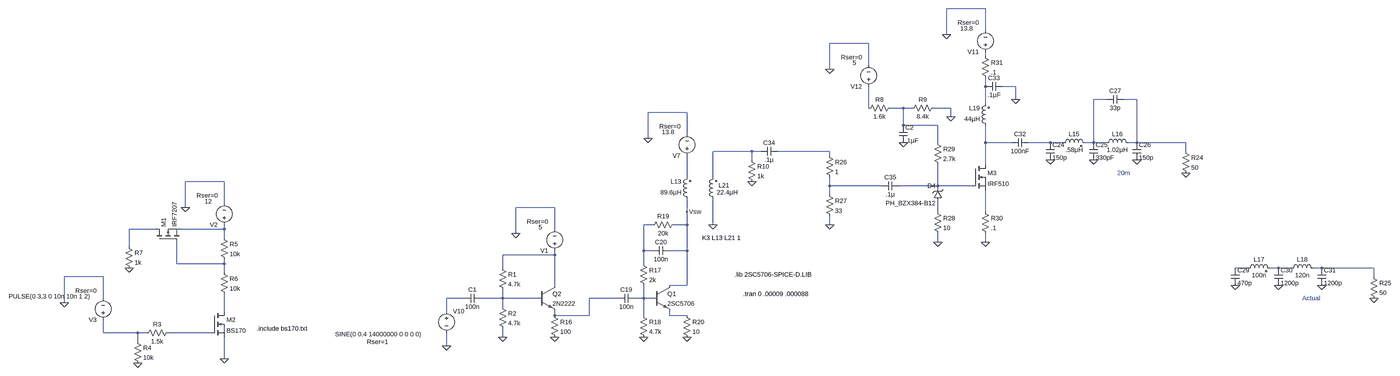
[diagram p0: schematic 10W IRF510 Amp - preamp v2.asc, whole sheet]
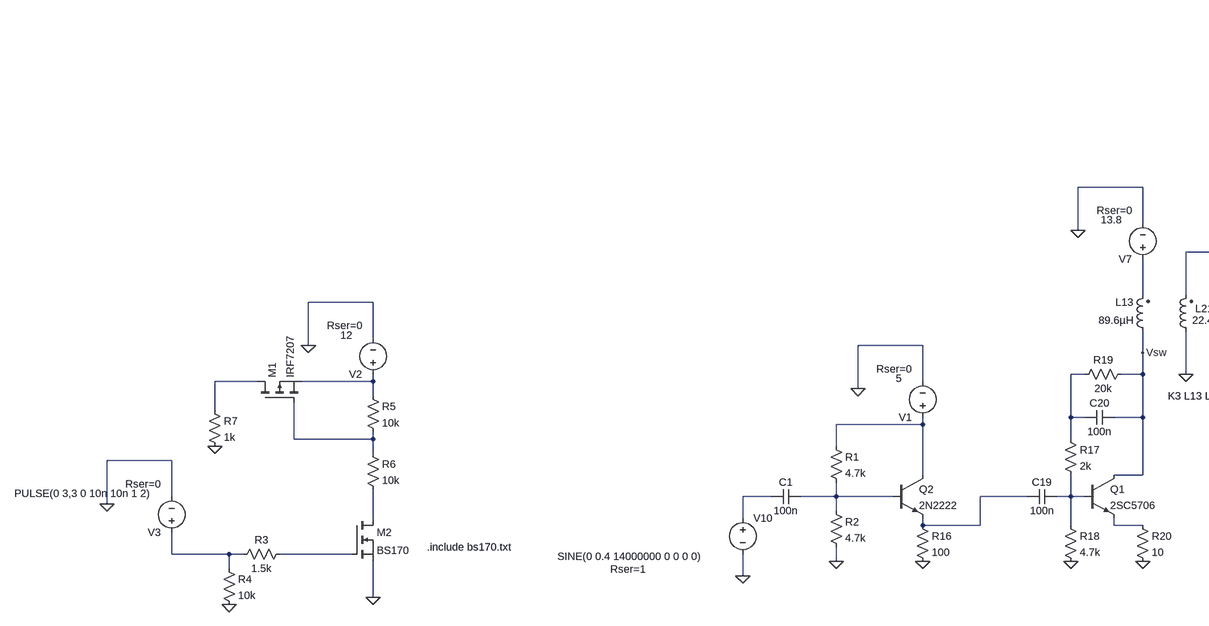
[diagram p1: schematic 10W IRF510 Amp - preamp v2.asc, part, row 1 of 1, column 1 of 2]
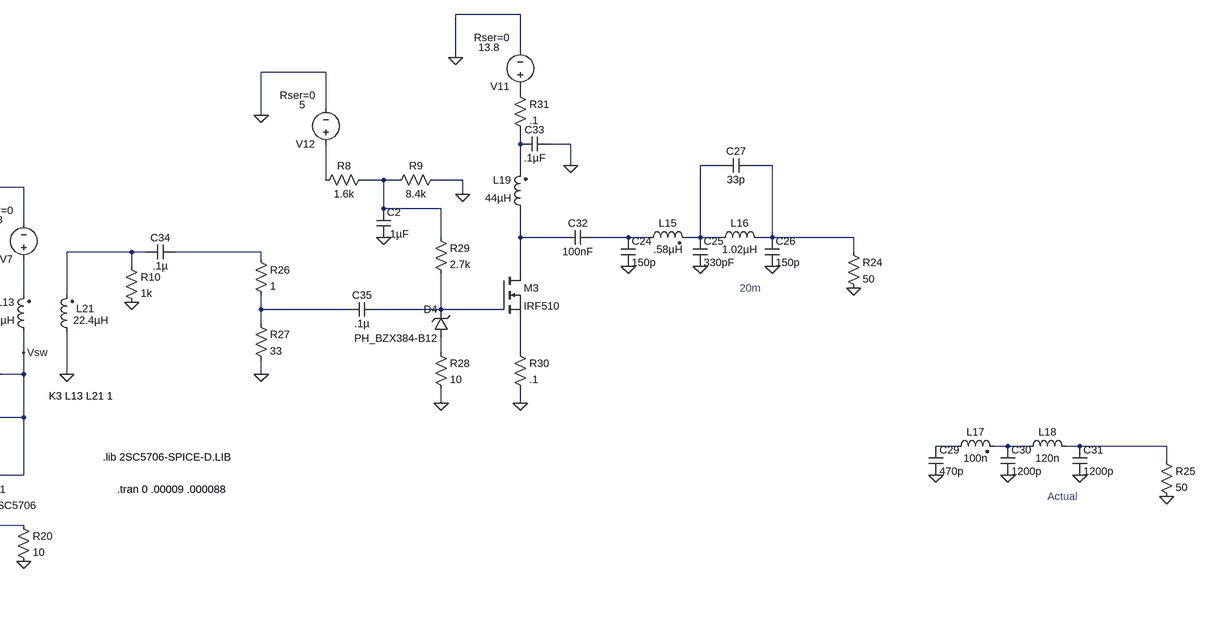
[diagram p2: schematic 10W IRF510 Amp - preamp v2.asc, part, row 1 of 1, column 2 of 2]
10W IRF510 Amp - preamp v2.asc, the LTspice schematic file:
Version 4
SHEET 1 3764 1240
WIRE 416 -3552 272 -3552
WIRE 416 -3472 416 -3552
WIRE 272 -3456 272 -3552
WIRE -16 -3424 -160 -3424
WIRE 416 -3376 416 -3392
WIRE -16 -3344 -16 -3424
WIRE -160 -3328 -160 -3424
WIRE 416 -3264 416 -3296
WIRE 528 -3264 480 -3264
WIRE 528 -3216 528 -3264
WIRE 864 -3216 816 -3216
WIRE 976 -3216 928 -3216
WIRE 416 -3200 416 -3264
WIRE -16 -3184 -16 -3264
WIRE 112 -3184 64 -3184
WIRE 144 -3184 112 -3184
WIRE 288 -3184 224 -3184
WIRE -688 -3168 -832 -3168
WIRE 288 -3152 288 -3184
WIRE 112 -3120 112 -3184
WIRE 240 -3120 112 -3120
WIRE -688 -3088 -688 -3168
WIRE -832 -3072 -832 -3168
WIRE 240 -3056 240 -3120
WIRE 416 -3056 416 -3120
WIRE 512 -3056 416 -3056
WIRE 656 -3056 576 -3056
WIRE 704 -3056 656 -3056
WIRE 816 -3056 816 -3216
WIRE 816 -3056 784 -3056
WIRE 864 -3056 816 -3056
WIRE 976 -3056 976 -3216
WIRE 976 -3056 944 -3056
WIRE 1344 -3056 976 -3056
WIRE -448 -3024 -592 -3024
WIRE -416 -3024 -448 -3024
WIRE -160 -3024 -352 -3024
WIRE 1344 -3024 1344 -3056
WIRE -160 -3008 -160 -3024
WIRE -448 -2992 -448 -3024
WIRE 416 -2976 416 -3056
WIRE -688 -2928 -688 -3008
WIRE -592 -2928 -592 -3024
WIRE -3536 -2912 -3680 -2912
WIRE -160 -2896 -160 -2928
WIRE 32 -2896 -160 -2896
WIRE 240 -2896 240 -2976
WIRE 240 -2896 96 -2896
WIRE 368 -2896 240 -2896
WIRE -160 -2864 -160 -2896
WIRE -3536 -2832 -3536 -2912
WIRE -3680 -2816 -3680 -2912
WIRE -1184 -2816 -1328 -2816
WIRE -688 -2800 -688 -2848
WIRE 240 -2800 240 -2832
WIRE 416 -2800 416 -2880
WIRE -816 -2752 -848 -2752
WIRE -688 -2752 -688 -2800
WIRE -688 -2752 -736 -2752
WIRE -592 -2752 -592 -2848
WIRE -160 -2752 -160 -2784
WIRE -3792 -2736 -3888 -2736
WIRE -3536 -2736 -3536 -2752
WIRE -3536 -2736 -3696 -2736
WIRE -1184 -2736 -1184 -2816
WIRE -1328 -2720 -1328 -2816
WIRE -3536 -2704 -3536 -2736
WIRE 240 -2688 240 -2720
WIRE 416 -2688 416 -2720
WIRE -3888 -2672 -3888 -2736
WIRE -848 -2656 -848 -2752
WIRE -816 -2656 -848 -2656
WIRE -688 -2656 -688 -2752
WIRE -688 -2656 -752 -2656
WIRE -1184 -2640 -1184 -2656
WIRE -1184 -2640 -1376 -2640
WIRE -3712 -2608 -3712 -2688
WIRE -3536 -2608 -3536 -2624
WIRE -3536 -2608 -3712 -2608
WIRE -848 -2608 -848 -2656
WIRE -1376 -2592 -1376 -2640
WIRE 2528 -2592 2480 -2592
WIRE 2640 -2592 2608 -2592
WIRE 2688 -2592 2640 -2592
WIRE 2800 -2592 2768 -2592
WIRE 3168 -2592 2800 -2592
WIRE -3536 -2576 -3536 -2608
WIRE -3984 -2560 -4128 -2560
WIRE 3168 -2560 3168 -2592
WIRE -1184 -2528 -1184 -2640
WIRE -688 -2528 -688 -2656
WIRE -688 -2528 -752 -2528
WIRE -3984 -2480 -3984 -2560
WIRE -1520 -2480 -1584 -2480
WIRE -1376 -2480 -1376 -2512
WIRE -1376 -2480 -1456 -2480
WIRE -1248 -2480 -1376 -2480
WIRE -944 -2480 -1056 -2480
WIRE -848 -2480 -848 -2528
WIRE -848 -2480 -880 -2480
WIRE -816 -2480 -848 -2480
WIRE -4128 -2464 -4128 -2560
WIRE -1376 -2448 -1376 -2480
WIRE -3536 -2432 -3536 -2496
WIRE -1584 -2432 -1584 -2480
WIRE -1184 -2416 -1184 -2432
WIRE -1056 -2416 -1056 -2480
WIRE -1056 -2416 -1184 -2416
WIRE -848 -2416 -848 -2480
WIRE -752 -2416 -752 -2432
WIRE -688 -2416 -752 -2416
WIRE -3984 -2352 -3984 -2400
WIRE -3856 -2352 -3984 -2352
WIRE -3824 -2352 -3856 -2352
WIRE -3584 -2352 -3744 -2352
WIRE -1376 -2336 -1376 -2368
WIRE -3856 -2320 -3856 -2352
WIRE -1584 -2304 -1584 -2352
WIRE -3536 -2256 -3536 -2336
FLAG -832 -3072 0
FLAG -1184 -2336 0
FLAG -848 -2336 0
FLAG -688 -2336 0
FLAG -688 -2800 Vsw
FLAG -1584 -2304 0
FLAG 1344 -2944 0
FLAG 656 -2992 0
FLAG 816 -2992 0
FLAG 976 -2992 0
FLAG 3168 -2480 0
FLAG 2480 -2528 0
FLAG 2640 -2528 0
FLAG 2800 -2528 0
FLAG 272 -3456 0
FLAG 528 -3216 0
FLAG -592 -2752 0
FLAG -160 -2752 0
FLAG 240 -2688 0
FLAG 416 -2688 0
FLAG -160 -3328 0
FLAG -1328 -2720 0
FLAG -1376 -2336 0
FLAG -3536 -2256 0
FLAG -3856 -2240 0
FLAG -3680 -2816 0
FLAG -4128 -2464 0
FLAG -3888 -2592 0
FLAG 288 -3152 0
FLAG 112 -3056 0
FLAG -448 -2912 0
SYMBOL npn -816 -2528 R0
SYMATTR InstName Q1
SYMATTR Value 2SC5706
SYMBOL voltage -688 -2992 R180
WINDOW 123 0 0 Left 0
WINDOW 39 24 124 Left 2
WINDOW 3 46 103 Left 2
SYMATTR SpiceLine Rser=0
SYMATTR Value 13.8
SYMATTR InstName V7
SYMBOL npn -1248 -2528 R0
SYMATTR InstName Q2
SYMATTR Value 2N2222
SYMBOL res -1200 -2432 R0
SYMATTR InstName R16
SYMATTR Value 100
SYMBOL cap -880 -2496 R90
WINDOW 0 0 32 VBottom 2
WINDOW 3 32 32 VTop 2
SYMATTR InstName C19
SYMATTR Value 100n
SYMBOL res -864 -2624 R0
SYMATTR InstName R17
SYMATTR Value 2k
SYMBOL res -864 -2432 R0
SYMATTR InstName R18
SYMATTR Value 4.7k
SYMBOL res -720 -2768 R90
WINDOW 0 0 56 VBottom 2
WINDOW 3 32 56 VTop 2
SYMATTR InstName R19
SYMATTR Value 20k
SYMBOL cap -752 -2672 R90
WINDOW 0 0 32 VBottom 2
WINDOW 3 32 32 VTop 2
SYMATTR InstName C20
SYMATTR Value 100n
SYMBOL ind2 -672 -2832 R180
WINDOW 0 36 80 Left 2
WINDOW 3 36 40 Left 2
SYMATTR InstName L13
SYMATTR Value 89.6µH
SYMATTR Type ind
SYMBOL res -704 -2432 R0
SYMATTR InstName R20
SYMATTR Value 10
SYMBOL voltage -1584 -2448 R0
WINDOW 123 0 0 Left 0
WINDOW 39 -295 129 Left 2
WINDOW 3 -412 101 Left 2
SYMATTR SpiceLine Rser=1
SYMATTR Value SINE(0 0.4 14000000 0 0 0 0)
SYMATTR InstName V10
SYMBOL res 1328 -3040 R0
SYMATTR InstName R24
SYMATTR Value 50
SYMBOL cap 640 -3056 R0
SYMATTR InstName C24
SYMATTR Value 150p
SYMBOL cap 800 -3056 R0
SYMATTR InstName C25
SYMATTR Value 330pF
SYMBOL cap 960 -3056 R0
SYMATTR InstName C26
SYMATTR Value 150p
SYMBOL ind2 688 -3040 R270
WINDOW 0 32 56 VTop 2
WINDOW 3 5 56 VBottom 2
SYMATTR InstName L15
SYMATTR Value .58µH
SYMATTR Type ind
SYMBOL ind 848 -3040 R270
WINDOW 0 32 56 VTop 2
WINDOW 3 5 56 VBottom 2
SYMATTR InstName L16
SYMATTR Value 1.02µH
SYMBOL cap 928 -3232 R90
WINDOW 0 0 32 VBottom 2
WINDOW 3 32 32 VTop 2
SYMATTR InstName C27
SYMATTR Value 33p
SYMBOL res 3152 -2576 R0
SYMATTR InstName R25
SYMATTR Value 50
SYMBOL cap 2464 -2592 R0
SYMATTR InstName C29
SYMATTR Value 470p
SYMBOL cap 2624 -2592 R0
SYMATTR InstName C30
SYMATTR Value 1200p
SYMBOL cap 2784 -2592 R0
SYMATTR InstName C31
SYMATTR Value 1200p
SYMBOL ind2 2512 -2576 R270
WINDOW 0 32 56 VTop 2
WINDOW 3 5 56 VBottom 2
SYMATTR InstName L17
SYMATTR Value 100n
SYMATTR Type ind
SYMBOL ind 2672 -2576 R270
WINDOW 0 32 56 VTop 2
WINDOW 3 5 56 VBottom 2
SYMATTR InstName L18
SYMATTR Value 120n
SYMBOL voltage 416 -3376 R180
WINDOW 123 0 0 Left 0
WINDOW 39 24 124 Left 2
WINDOW 3 46 103 Left 2
SYMATTR SpiceLine Rser=0
SYMATTR Value 13.8
SYMATTR InstName V11
SYMBOL ind2 432 -3104 R180
WINDOW 0 36 80 Left 2
WINDOW 3 36 40 Left 2
SYMATTR InstName L19
SYMATTR Value 44µH
SYMATTR Type ind
SYMBOL cap 576 -3072 R90
WINDOW 0 0 32 VBottom 2
WINDOW 3 32 32 VTop 2
SYMATTR InstName C32
SYMATTR Value 100nF
SYMBOL ind2 -576 -2832 R180
WINDOW 0 -45 66 Left 2
WINDOW 3 -76 40 Left 2
SYMATTR InstName L21
SYMATTR Value 22.4µH
SYMATTR Type ind
SYMBOL cap 480 -3280 R90
WINDOW 0 0 32 VBottom 2
WINDOW 3 32 32 VTop 2
SYMATTR InstName C33
SYMATTR Value .1µF
SYMBOL cap -352 -3040 R90
WINDOW 0 0 32 VBottom 2
WINDOW 3 32 32 VTop 2
SYMATTR InstName C34
SYMATTR Value .1µ
SYMBOL zener 256 -2832 R180
WINDOW 0 24 64 Left 2
WINDOW 3 24 0 Left 2
SYMATTR InstName D4
SYMATTR Value PH_BZX384-B12
SYMBOL res -176 -3024 R0
SYMATTR InstName R26
SYMATTR Value 1
SYMBOL res -176 -2880 R0
SYMATTR InstName R27
SYMATTR Value 33
SYMBOL cap 96 -2912 R90
WINDOW 0 0 32 VBottom 2
WINDOW 3 32 32 VTop 2
SYMATTR InstName C35
SYMATTR Value .1µ
SYMBOL res 224 -2816 R0
SYMATTR InstName R28
SYMATTR Value 10
SYMBOL nmos 368 -2976 R0
SYMATTR InstName M3
SYMATTR Value IRF510
SYMBOL res 224 -3072 R0
SYMATTR InstName R29
SYMATTR Value 2.7k
SYMBOL voltage -16 -3248 R180
WINDOW 123 0 0 Left 0
WINDOW 39 24 124 Left 2
WINDOW 3 46 103 Left 2
SYMATTR SpiceLine Rser=0
SYMATTR Value 5
SYMATTR InstName V12
SYMBOL res 400 -2816 R0
SYMATTR InstName R30
SYMATTR Value .1
SYMBOL res 400 -3392 R0
SYMATTR InstName R31
SYMATTR Value .1
SYMBOL cap -1456 -2496 R90
WINDOW 0 0 32 VBottom 2
WINDOW 3 32 32 VTop 2
SYMATTR InstName C1
SYMATTR Value 100n
SYMBOL voltage -1184 -2640 R180
WINDOW 123 0 0 Left 0
WINDOW 39 24 124 Left 2
WINDOW 3 46 103 Left 2
SYMATTR SpiceLine Rser=0
SYMATTR Value 5
SYMATTR InstName V1
SYMBOL res -1392 -2608 R0
SYMATTR InstName R1
SYMATTR Value 4.7k
SYMBOL res -1392 -2464 R0
SYMATTR InstName R2
SYMATTR Value 4.7k
SYMBOL nmos -3584 -2432 R0
SYMATTR InstName M2
SYMATTR Value BS170
SYMATTR Prefix X
SYMBOL res -3728 -2368 R90
WINDOW 0 0 56 VBottom 2
WINDOW 3 32 56 VTop 2
SYMATTR InstName R3
SYMATTR Value 1.5k
SYMBOL res -3872 -2336 R0
SYMATTR InstName R4
SYMATTR Value 10k
SYMBOL voltage -3536 -2736 R180
WINDOW 123 0 0 Left 0
WINDOW 39 24 124 Left 2
WINDOW 3 46 103 Left 2
SYMATTR SpiceLine Rser=0
SYMATTR Value 12
SYMATTR InstName V2
SYMBOL res -3552 -2720 R0
SYMATTR InstName R5
SYMATTR Value 10k
SYMBOL res -3552 -2592 R0
SYMATTR InstName R6
SYMATTR Value 10k
SYMBOL voltage -3984 -2384 R180
WINDOW 123 0 0 Left 0
WINDOW 39 24 124 Left 2
WINDOW 3 46 103 Left 2
SYMATTR SpiceLine Rser=0
SYMATTR Value PULSE(0 3,3 0 10n 10n 1 2)
SYMATTR InstName V3
SYMBOL pmos -3792 -2688 R270
SYMATTR InstName M1
SYMATTR Value IRF7207
SYMBOL res -3904 -2688 R0
SYMATTR InstName R7
SYMATTR Value 1k
SYMBOL res 80 -3200 R90
WINDOW 0 0 56 VBottom 2
WINDOW 3 32 56 VTop 2
SYMATTR InstName R8
SYMATTR Value 1.6k
SYMBOL res 240 -3200 R90
WINDOW 0 0 56 VBottom 2
WINDOW 3 32 56 VTop 2
SYMATTR InstName R9
SYMATTR Value 8.4k
SYMBOL res -464 -3008 R0
SYMATTR InstName R10
SYMATTR Value 1k
SYMBOL cap 96 -3120 R0
SYMATTR InstName C2
SYMATTR Value .1µF
TEXT -512 -2568 Left 2 !.lib 2SC5706-SPICE-D.LIB
TEXT 904 -2944 Left 2 ;20m
TEXT 2728 -2480 Left 2 ;Actual
TEXT -632 -2704 Left 2 !K3 L13 L21 1
TEXT -480 -2496 Left 2 !.tran 0 .00009 .000088
TEXT -3416 -2368 Left 2 !.include bs170.txt

The netlist it stands for:
* 10W IRF510 Amp - preamp v2.asc
Q1 Vsw N027 N029 0 2SC5706
V7 N011 0 13.8 Rser=0
Q2 N019 N025 N026 0 2N2222
R16 N026 0 100
C19 N027 N026 100n
R17 N016 N027 2k
R18 N027 0 4.7k
R19 Vsw N016 20k
C20 Vsw N016 100n
L13 Vsw N011 89.6µH
R20 N029 0 10
V10 N024 0 SINE(0 0.4 14000000 0 0 0 0) Rser=1
R24 N004 0 50
C24 N008 0 150p
C25 N003 0 330pF
C26 N004 0 150p
L15 N008 N003 .58µH
L16 N003 N004 1.02µH
C27 N004 N003 33p
R25 N023 0 50
C29 N021 0 470p
C30 N022 0 1200p
C31 N023 0 1200p
L17 N021 N022 100n
L18 N022 N023 120n
V11 N001 0 13.8 Rser=0
L19 N007 N002 44µH
C32 N008 N007 100nF
L21 0 N009 22.4µH
C33 0 N002 .1µF
C34 N010 N009 .1µ
D4 N014 N013 PH_BZX384-B12
R26 N010 N012 1
R27 N012 0 33
C35 N013 N012 .1µ
R28 N014 0 10
M3 N007 N013 N015 N015 IRF510
R29 N006 N013 2.7k
V12 N005 0 5 Rser=0
R30 N015 0 .1
R31 N001 N002 .1
C1 N025 N024 100n
V1 N019 0 5 Rser=0
R1 N019 N025 4.7k
R2 N025 0 4.7k
XM2 N028 N031 0 BS170  ; pins D G S
R3 N031 N030 1.5k
R4 N030 0 10k
V2 N018 0 12 Rser=0
R5 N018 N020 10k
R6 N020 N028 10k
V3 N030 0 PULSE(0 3,3 0 10n 10n 1 2) Rser=0
M1 N017 N020 N018 N018 IRF7207
R7 N017 0 1k
R8 N006 N005 1.6k
R9 0 N006 8.4k
R10 N009 0 1k
C2 N006 0 .1µF
.model D D
.lib standard.dio
.model NPN NPN
.model PNP PNP
.lib standard.bjt
.model NMOS NMOS
.model PMOS PMOS
.lib standard.mos
.lib 2SC5706-SPICE-D.LIB
* 20m
* Actual
K3 L13 L21 1
.tran 0 .00009 .000088
.include bs170.txt
.backanno
.end